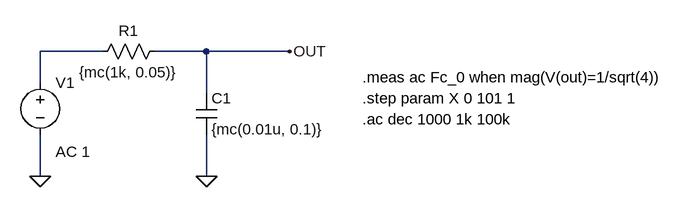
[diagram p0: schematic RC_mc.asc]
RC_mc.asc, the LTspice schematic file:
Version 4
SHEET 1 880 680
WIRE -608 -32 -704 -32
WIRE -448 -32 -528 -32
WIRE -320 -32 -448 -32
WIRE -704 16 -704 -32
WIRE -448 32 -448 -32
WIRE -704 160 -704 96
WIRE -448 160 -448 96
FLAG -704 160 0
FLAG -448 160 0
FLAG -320 -32 OUT
SYMBOL res -512 -48 R90
WINDOW 0 0 56 VBottom 2
WINDOW 3 32 56 VTop 2
SYMATTR InstName R1
SYMATTR Value {mc(1k, 0.05)}
SYMBOL cap -464 32 R0
SYMATTR InstName C1
SYMATTR Value {mc(0.01u, 0.1)}
SYMBOL voltage -704 0 R0
WINDOW 123 24 122 Left 2
WINDOW 39 0 0 Left 2
SYMATTR Value2 AC 1
SYMATTR InstName V1
SYMATTR Value ""
TEXT -208 72 Left 2 !.ac dec 1000 1k 100k
TEXT -208 8 Left 2 !.meas ac Fc_0 when mag(V(out)=1/sqrt(4))
TEXT -208 40 Left 2 !.step param X 0 101 1

The netlist it stands for:
* RC_mc.asc
R1 OUT N001 {mc(1k, 0.05)}
C1 OUT 0 {mc(0.01u, 0.1)}
V1 N001 0 AC 1
.ac dec 1000 1k 100k
.meas ac Fc_0 when mag(V(out)=1/sqrt(4))
.step param X 0 101 1
.backanno
.end